# EAGLE design CrackberryPi_1.0.6.2_parts (EAGLE 7.2.0)
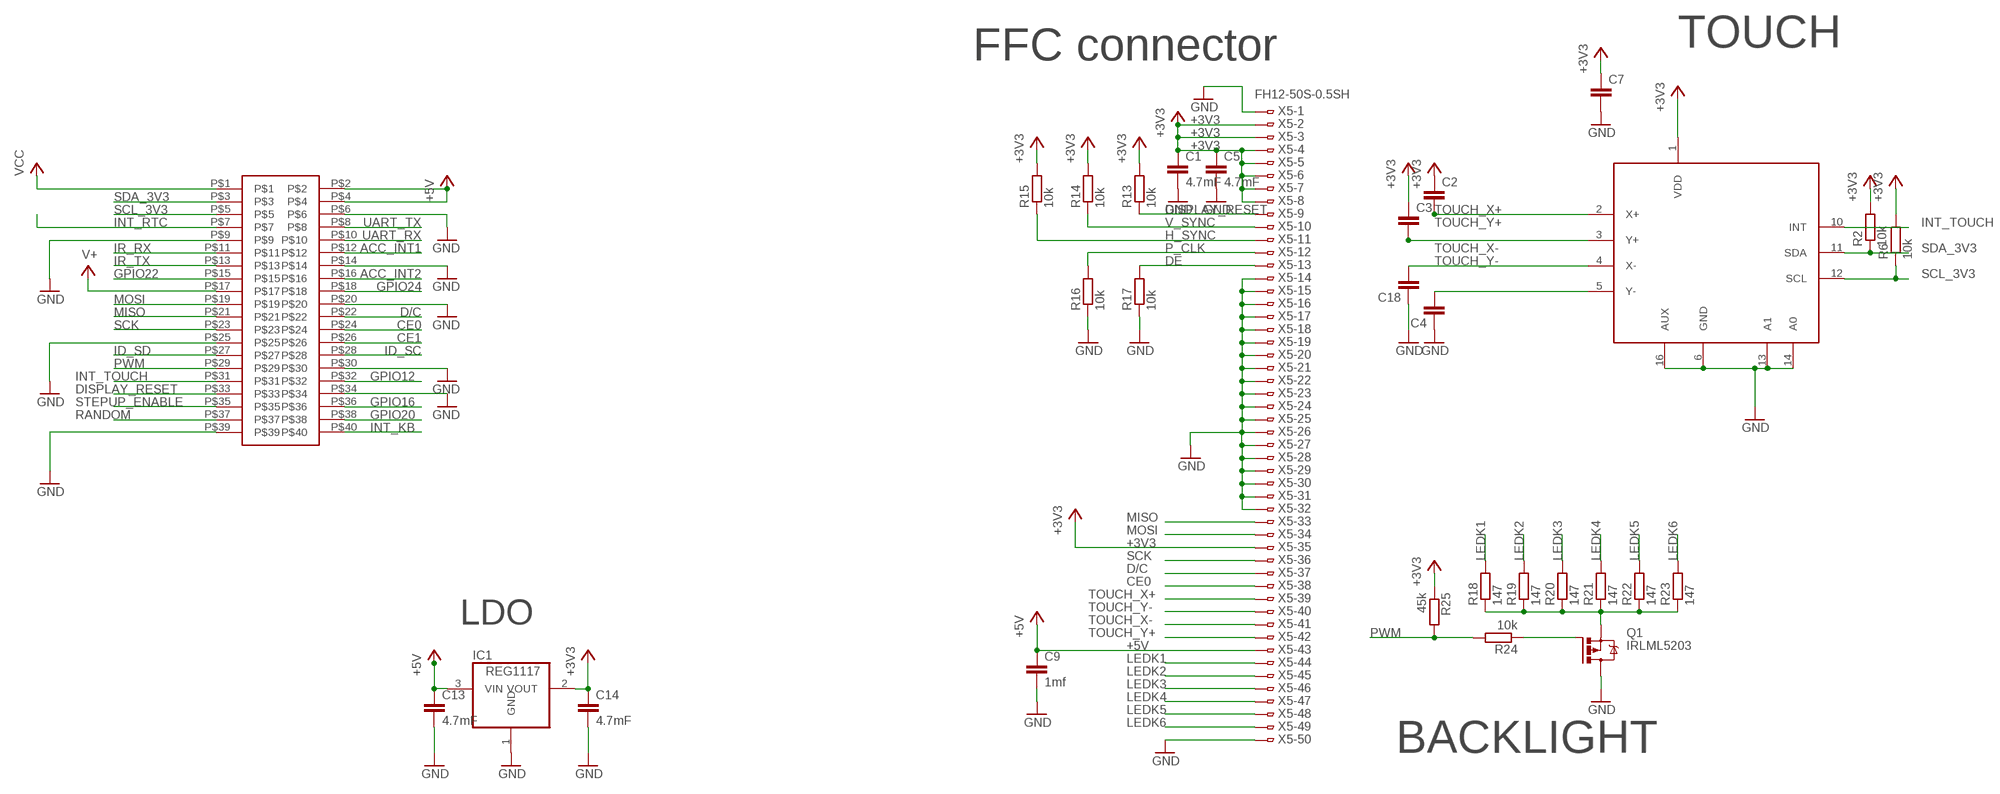
[diagram p0: schematic, sheet 1]

## Parts
C1  4.7mF  C-EUC0603  [C0603]
C2  C-EUC0603  [C0603]
C3  C-EUC0603  [C0603]
C4  C-EUC0603  [C0603]
C5  4.7mF  C-EUC0603  [C0603]
C7  C-EUC0603  [C0603]
C9  1mf  C-EUC0603  [C0603]
C13  4.7mF  C-EUC0603  [C0603]
C14  4.7mF  C-EUC0603  [C0603]
C18  C-EUC0603  [C0603]
IC1  REG1117  [SOT223]
Q1  IRLML5203  [MICRO3]
R2  10k  R-EU_R0603  [R0603]
R6  10k  R-EU_R0603  [R0603]
R13  10k  R-EU_R0603  [R0603]
R14  10k  R-EU_R0603  [R0603]
R15  10k  R-EU_R0603  [R0603]
R16  10k  R-EU_R0603  [R0603]
R17  10k  R-EU_R0603  [R0603]
R18  147  R-EU_R0603  [R0603]
R19  147  R-EU_R0603  [R0603]
R20  147  R-EU_R0603  [R0603]
R21  147  R-EU_R0603  [R0603]
R22  147  R-EU_R0603  [R0603]
R23  147  R-EU_R0603  [R0603]
R24  10k  R-EU_R0603  [R0603]
R25  45k  R-EU_R0603  [R0603]
U$6  TSC2007  [TSSOP16]
U$11  HEADER  [20X2]
X5  FH12-50S-0.5SH  [FH12-50S-0.5SH]

## Nets
+3V3: C1.1 C2.1 C3.1 C5.1 C7.1 C14.1 IC1.2(VOUT) R2.2 R6.2 R13.2 R14.2 R15.2 R25.1 U$6.1(VDD) X5.2 X5.3 X5.4 X5.5 X5.6 X5.7 X5.8 X5.35
+5V: C9.1 C13.1 IC1.3(VIN) U$11.P$2 U$11.P$4 X5.43
ACC_INT1: U$11.P$12
ACC_INT2: U$11.P$16
CE0: U$11.P$24 X5.38
CE1: U$11.P$26
D/C: U$11.P$22 X5.37
DE: R17.2 X5.13
DISPLAY_RESET: R13.1 U$11.P$33 X5.9
GND: C1.2 C4.1 C5.2 C7.2 C9.2 C13.2 C14.2 C18.1 IC1.1(GND) Q1.3(D) R16.1 R17.1 U$6.6(GND) U$6.13(A1) U$6.14(A0) U$6.16(AUX) U$11.P$6 U$11.P$9 U$11.P$14 U$11.P$20 U$11.P$25 U$11.P$30 U$11.P$34 U$11.P$39 X5.1 X5.14 X5.15 X5.16 X5.17 X5.18 X5.19 X5.20 X5.21 X5.22 X5.23 X5.24 X5.25 X5.26 X5.27 X5.28 X5.29 X5.30 X5.31 X5.32 X5.50
GPIO12: U$11.P$32
GPIO16: U$11.P$36
GPIO20: U$11.P$38
GPIO22: U$11.P$15
GPIO24: U$11.P$18
H_SYNC: R15.1 X5.11
ID_SC: U$11.P$28
ID_SD: U$11.P$27
INT_KB: U$11.P$40
INT_RTC: U$11.P$7
INT_TOUCH: U$6.10(INT) U$11.P$31
IR_RX: U$11.P$11
IR_TX: U$11.P$13
LEDK1: R18.2 X5.44
LEDK2: R19.2 X5.45
LEDK3: R20.2 X5.46
LEDK4: R21.2 X5.47
LEDK5: R22.2 X5.48
LEDK6: R23.2 X5.49
MISO: U$11.P$21 X5.33
MOSI: U$11.P$19 X5.34
N$12: Q1.2(S) R18.1 R19.1 R20.1 R21.1 R22.1 R23.1
N$20: Q1.1(G) R24.1
P_CLK: R16.2 X5.12
PWM: R24.2 R25.2 U$11.P$29
RANDOM: U$11.P$37
SCK: U$11.P$23 X5.36
SCL_3V3: R6.1 U$6.12(SCL) U$11.P$5
SDA_3V3: R2.1 U$6.11(SDA) U$11.P$3
STEPUP_ENABLE: U$11.P$35
TOUCH_X+: C2.2 U$6.2(X+) X5.39
TOUCH_X-: C18.2 U$6.4(X-) X5.41
TOUCH_Y+: C3.2 U$6.3(Y+) X5.42
TOUCH_Y-: C4.2 U$6.5(Y-) X5.40
UART_RX: U$11.P$10
UART_TX: U$11.P$8
V+: U$11.P$17
V_SYNC: R14.1 X5.10
VCC: U$11.P$1

## Notes on the sheet
- FFC connector | TOUCH
- LDO
- BACKLIGHT

## Library data of the parts
C1-C5 C7 C9 C13 C14 C18 = rcl:C-EU: CAPACITOR, European symbol
IC1 = burr-brown:REG1117: 800mA and 1A Low Dropout (LDO) Positive Regulator 1.8V, 2.5V, 2.85V, 3.3V, 5V, and Adj; MPN: REG1117; OC_FARNELL: 1097566; OC_NEWARK: 14P6981
Q1 = transistor-power:IRLML5203: HEXFET P-Channel Power MOSFET
R2 R6 R13-R25 = rcl:R-EU_: RESISTOR, European symbol
U$6 = tsc2046:TSC2007
U$11 = 20x2_cirqoid:HEADER
X5 = FCI_62684:FH12-50S-0.5S: 0.5mm Pitch Connectors For FPC/FFC Source: Data sheet <http://www.hirose.co.jp/cataloge_hp/e58605370.pdf>; MPN: FH12-50S-0.5SH(55); OC_FARNELL: 1324557; OC_NEWARK: 34M6181

## Board
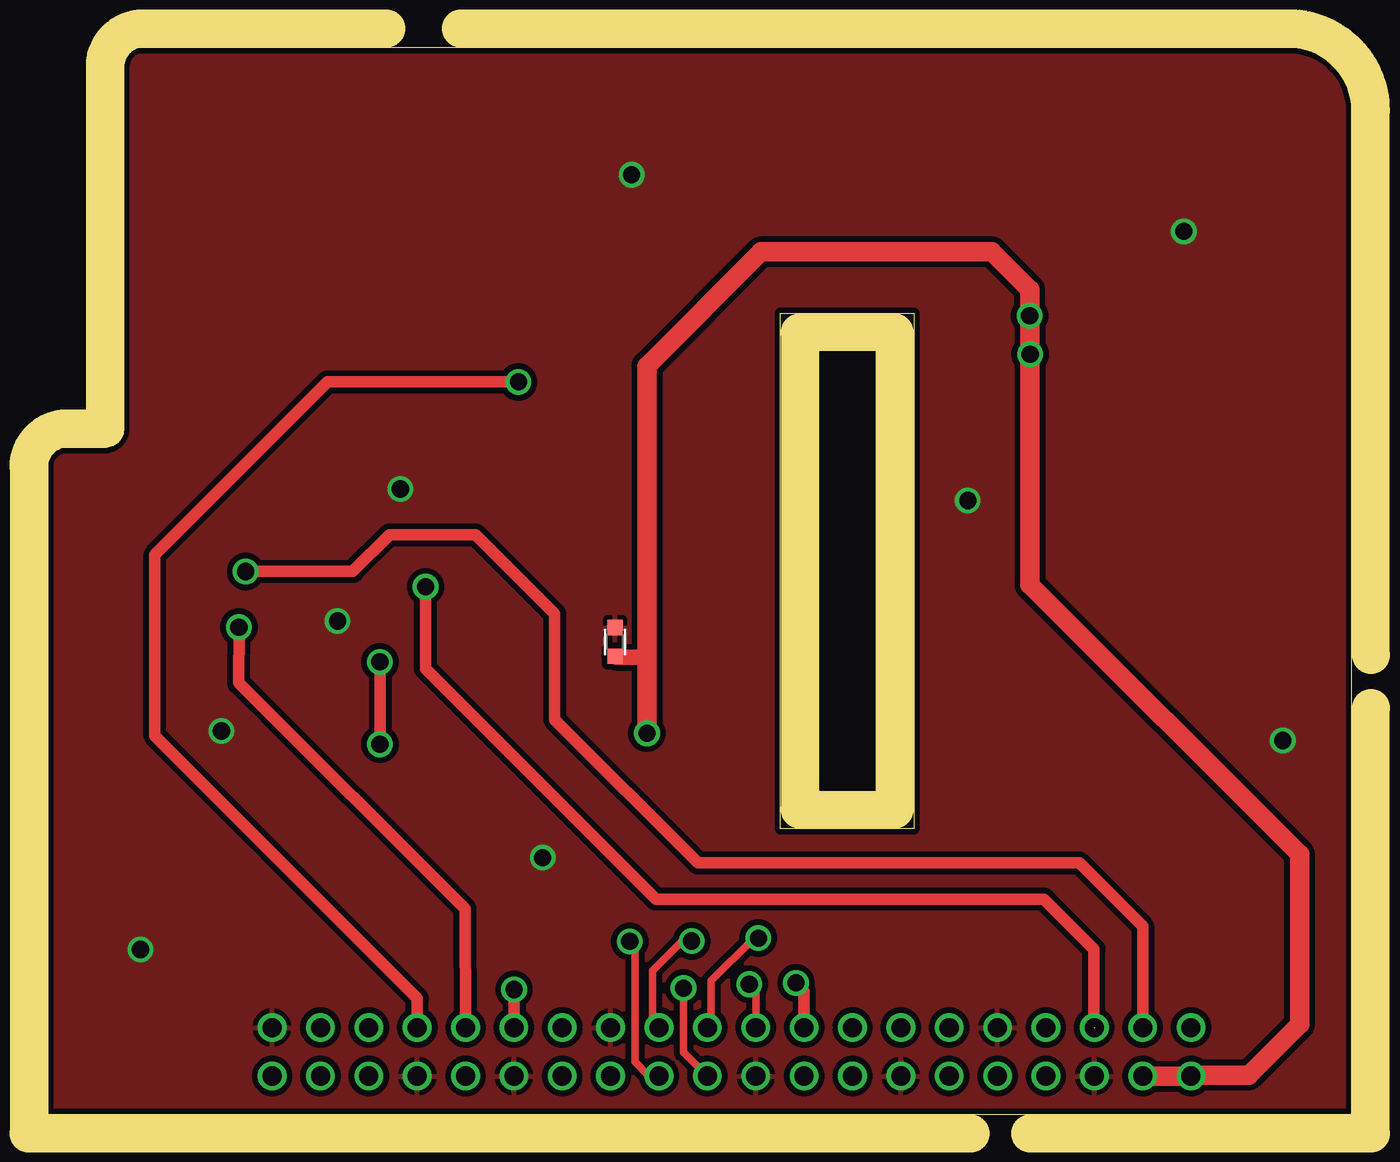
[diagram p1: board, top side]
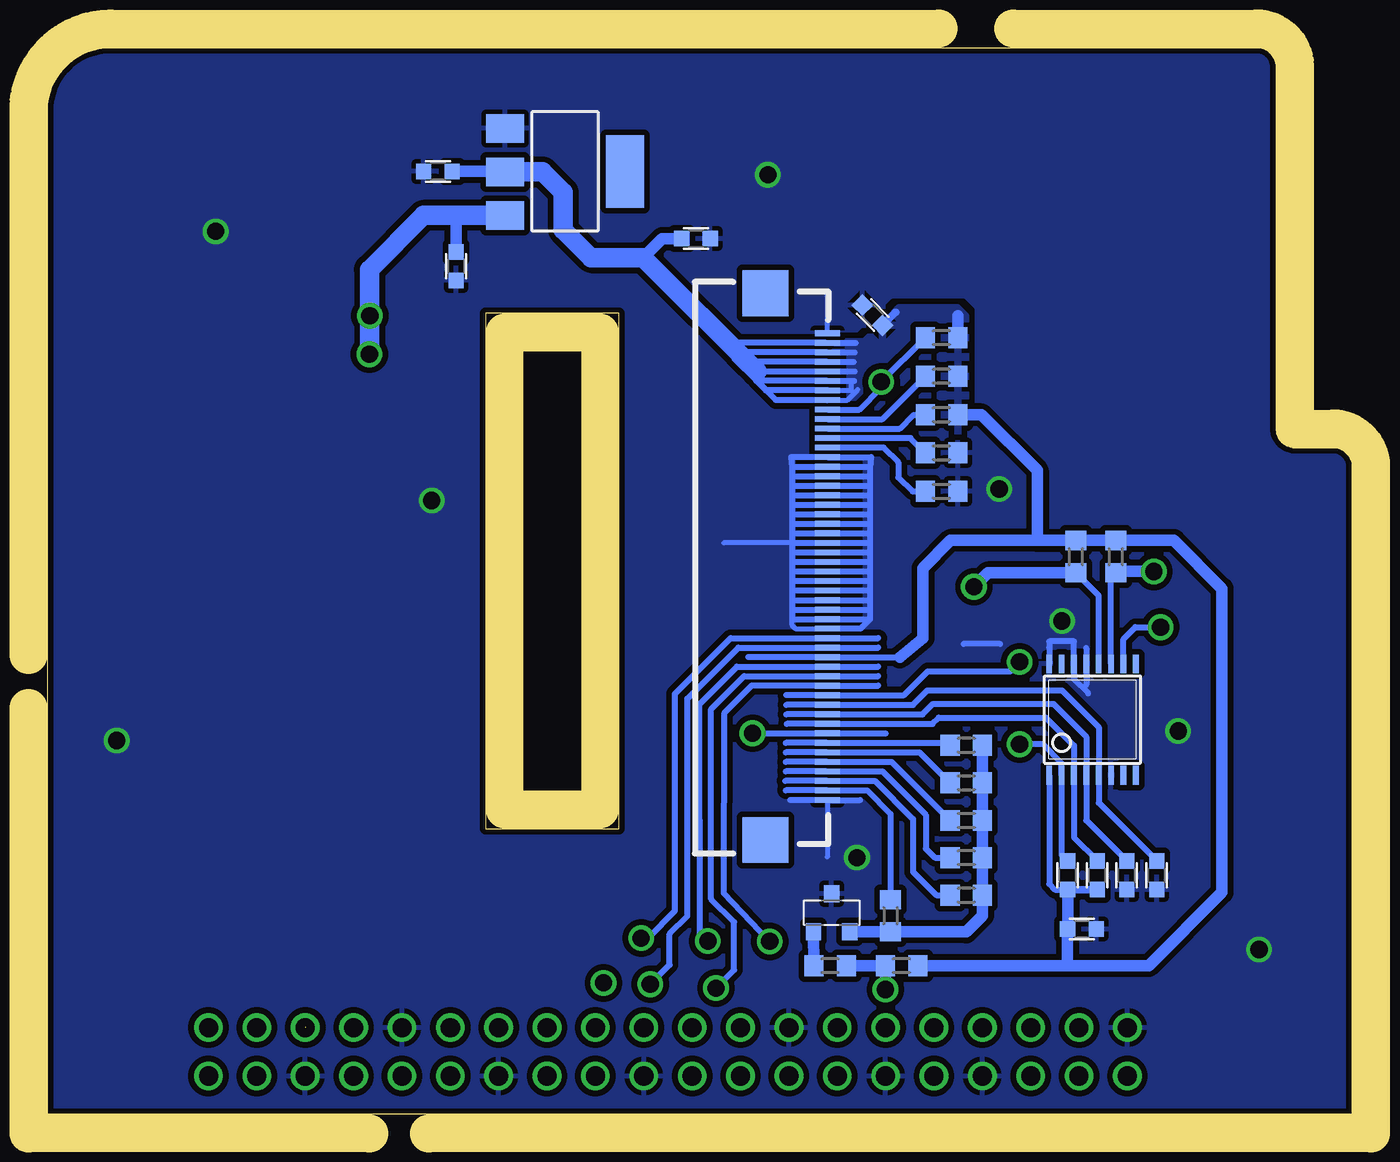
[diagram p2: board, bottom side, seen from below]

Size 68.5 x 56 mm. Coordinates in mm from the lower left corner, seen from the top.
Outline: 0,34 0,0 68.5,0 68.5,52.7 arc90 65.2,56 5,56 arc90 4,55 4,36 arc-90 3,35 1,35 arc90 0,34
Outline: 45.5,15 38.5,15 38.5,42.05 45.5,42.05 45.5,15
Copper layers (1*16): Top 0.035mm / dielectric 1.5mm / Bottom 0.035mm
Design rules "SeeedStudio_2layer_DRU_no_angle_20140221": minimum track width 6mil, minimum drill 12mil, track to track 6mil, track to pad 6mil, pad to pad 6mil, via to via 6mil, smd to smd 0mil, copper to edge 10mil, drill to drill 10mil, minimum pad ring 10mil, minimum via ring 6mil, stop-mask expansion 2mil, vias tented up to drill 100mil, thermal gap 10mil
tRestrict: area 38.5,15 to 45.5,42
bRestrict: area 26,33.2 to 28.9,33.3; area 26,32.7 to 28.9,32.8; area 26,32.2 to 28.9,32.3; area 26,31.7 to 28.9,31.8; area 26,31.2 to 28.9,31.3; area 26,30.7 to 28.9,30.8; area 26,30.2 to 28.9,30.3; area 26,29.7 to 28.9,29.8; area 26,29.2 to 28.9,29.3; area 26,28.7 to 28.9,28.8; area 26,28.2 to 28.9,28.3; area 26,27.7 to 28.9,27.8; 13 more areas
Milling: 17 lines

### Footprints (pad centres in the part's own frame; a part is rotated, then mirrored left to right if it is on the bottom)
C0603 = smd 0.8 x 0.8: 1 -0.75,0; 2 0.75,0
SOT223 = smd 1.499 x 2.007: 1 -2.261,-3.15; 2 0.025,-3.15; 3 2.311,-3.15 | smd 3.81 x 2.007: 4 0,3.15
MICRO3 = smd 0.8 x 0.9: 1 -0.95,-1; 2 0.95,-1; 3 0,1
R0603 = smd 1 x 1.1: 1 -0.85,0; 2 0.85,0
TSSOP16 = smd 0.305 x 0.991: 1 -2.275,-2.918; 2 -1.625,-2.918; 3 -0.975,-2.918; 4 -0.325,-2.918; 5 0.325,-2.918; 6 0.975,-2.918; 7 1.625,-2.918; 8 2.275,-2.918; 9 2.275,2.918; 10 1.625,2.918; 11 0.975,2.918; 12 0.325,2.918; 13 -0.325,2.918; 14 -0.975,2.918; 15 -1.625,2.918; 16 -2.275,2.918
20X2 = drill 1: P$1 0,0; P$2 0,2.54; P$3 2.54,0; P$4 2.54,2.54; P$5 5.08,0; P$6 5.08,2.54; P$7 7.62,0; P$8 7.62,2.54; P$9 10.16,0; P$10 10.16,2.54; P$11 12.7,0; P$12 12.7,2.54; P$13 15.24,0; P$14 15.24,2.54; P$15 17.78,0; P$16 17.78,2.54; P$17 20.32,0; P$18 20.32,2.54; P$19 22.86,0; P$20 22.86,2.54; P$21 25.4,0; P$22 25.4,2.54; P$23 27.94,0; P$24 27.94,2.54; P$25 30.48,0; P$26 30.48,2.54; P$27 33.02,0; P$28 33.02,2.54; P$29 35.56,0; P$30 35.56,2.54; P$31 38.1,0; P$32 38.1,2.54; P$33 40.64,0; P$34 40.64,2.54; P$35 43.18,0; P$36 43.18,2.54; P$37 45.72,0; P$38 45.72,2.54; P$39 48.26,0; P$40 48.26,2.54
FH12-50S-0.5SH = smd 1.3 x 0.3: 1 3.95,27.8; 2 3.95,27.3; 3 3.95,26.8; 4 3.95,26.3; 5 3.95,25.8; 6 3.95,25.3; 7 3.95,24.8; 8 3.95,24.3; 9 3.95,23.8; 10 3.95,23.3; 11 3.95,22.8; 12 3.95,22.3; 13 3.95,21.8; 14 3.95,21.3; 15 3.95,20.8; 16 3.95,20.3; 17 3.95,19.8; 18 3.95,19.3; 19 3.95,18.8; 20 3.95,18.3; 21 3.95,17.8; 22 3.95,17.3; 23 3.95,16.8; 24 3.95,16.3; 25 3.95,15.8; 26 3.95,15.3; 27 3.95,14.8; 28 3.95,14.3; 29 3.95,13.8; 30 3.95,13.3; 31 3.95,12.8; 32 3.95,12.3; 33 3.95,11.8; 34 3.95,11.3; 35 3.95,10.8; 36 3.95,10.3; 37 3.95,9.8; 38 3.95,9.3; 39 3.95,8.8; 40 3.95,8.3; 41 3.95,7.8; 42 3.95,7.3; 43 3.95,6.8; 44 3.95,6.3; 45 3.95,5.8; 46 3.95,5.3; 47 3.95,4.8; 48 3.95,4.3; 49 3.95,3.8; 50 3.95,3.3 | smd 2.4 x 2.4: P$1 0.7,1.2; P$2 0.7,29.9

### Placement (x,y rotation side)
C1  25.18,41.95 135 bottom
C2  14.93,12.55 90 bottom
C3  13.38,12.55 90 bottom
C4  10.25,12.55 90 bottom
C5  34.45,45.98 0 bottom
C7  14.18,9.72 0 bottom
C9  29.8,24.8 90 top
C13  47.05,44.52 270 bottom
C14  48,49.5 180 bottom
C18  11.82,12.55 90 bottom
IC1  41.33,49.5 270 bottom
Q1  27.32,10.57 0 bottom
R2  12.4,29.27 90 bottom
R6  14.5,29.27 90 bottom
R13  21.55,40.77 0 bottom
R14  21.55,38.75 0 bottom
R15  21.55,36.73 0 bottom
R16  21.55,34.73 180 bottom
R17  21.55,32.7 180 bottom
R18  20.25,19.38 180 bottom
R19  20.25,17.4 180 bottom
R20  20.25,15.43 180 bottom
R21  20.25,13.47 180 bottom
R22  20.25,11.5 180 bottom
R23  24.23,10.43 90 bottom
R24  27.4,7.8 0 bottom
R25  23.65,7.8 180 bottom
U$6  13.62,20.73 0 bottom
U$11  60.05,4.55 180 top
X5  31.5,13.2 0 bottom

### Tracks (layer width: path | path; a pad name or v marks a point on that pad's centre or on a via)
+3V3
  Bottom 0.254: X5.3 27.52,39.98 | X5.8 27.48,37.5 26.5,37.5 25.95,38.05 | X5.7 26.27,38 26.27,38.5
  Bottom 0.305: 23.75,24 X5.35 31.7,24 | 26.15,38.5 26.27,38.5 X5.6 31.25,38.5 | 26.1,39 X5.5 31.25,39 | 26.18,39.5 X5.4 31.77,39.5 32.1,39.83 | 26.12,40 X5.3 32.2,40 32.48,40.27 | X5.2 26.05,40.5 | U$6.1 15.9,12.1 15.6,11.8 C2.1 | 27.57,37.5 X5.8 | 31.25,38.5 32.45,39.7 | 27.48,37.5 30.25,37.5 31.25,38.5
  Bottom 0.406: 23.95,42.1 23.96,42.1 C1.1 | C3.1 C2.1
  Bottom 0.61: 20.7,41.92 R13.2 | R15.2 19.45,36.73 16.52,33.8 16.52,30.12 | C2.1 C7.1 14.95,9.7 14.95,7.8 | 16.52,30.12 R6.2 R2.2 9.35,30.12 6.83,27.6 6.83,11.65 10.68,7.8 14.95,7.8 | C14.1 44.5,49.5 IC1.2 | 14.95,7.8 R25.1 | 16.52,30.12 21.07,30.12 22.52,28.68 22.52,25 23.75,24 | C5.1 36.23,45.98 37.23,44.98
  Bottom 1.016: IC1.2 42.5,49.48 41.42,48.4 41.42,46.45 39.95,44.98 37.23,44.98 31.25,39
  pour Bottom (isolate 0.305): 20.3,35.88 28.1,35.88 28.1,40.55 25.6,40.55 23.8,42.35 20.73,42.35 20.3,41.92
+5V  (via drill 0.9)
  Top 0.813: C9.1 29.85,24 31.48,24
  Top 1.016: U$11.P$4 U$11.P$2 60.05,2.05 63.08,2.05 65.75,4.72 65.75,13.65 51.6,27.8 v51.6,39.9 51.6,41.9 v51.58,41.92 51.58,43.3 49.6,45.27 37.48,45.27 31.48,39.27 31.48,24 v31.48,20
  Bottom 0.254: U$11.P$2 60.05,2.05
  Bottom 0.305: 24.48,20 X5.43 v31.48,20
  Bottom 0.61: C13.1 47.05,47.19
  Bottom 1.016: IC1.3 47.05,47.19 48.76,47.19 51.6,44.35 v51.6,39.9
CE0  (via drill 0.9)
  Top 0.406: v30.57,9.07 30.85,8.8 30.85,2.75 31.59,2.01 U$11.P$24
  Bottom 0.305: 24.88,22.5 X5.38 31.52,22.5 32.98,21.05 33,11.62 v30.57,9.07
D/C  (via drill 0.9)
  Top 0.406: U$11.P$22 33.4,3.26 v33.4,6.62
  Bottom 0.305: 27.65,23 X5.37 | X5.37 24.88,23 | v33.4,6.62 32.45,7.58 32.45,10.1 33.65,11.3 33.65,21.27 31.93,23 X5.37
DE
  Bottom 0.305: X5.13 24.6,35 23.82,34.23 23.82,33.42 23.07,32.7 R17.2
DISPLAY_RESET  (via drill 0.9)
  Top 0.61: U$11.P$33 19.41,6.09 5.62,19.88 5.62,29.38 14.7,38.45 v24.73,38.45
  Bottom 0.305: R13.1 v24.73,38.45 24.73,38.15 25.88,37 X5.9
GND  (via drill 0.9)
  Bottom 0.254: 27.5,25.5 29.23,25.5 29.4,25.68 29.4,26 | X5.50 27.55,13.5 | X5.1 27.55,42.98 | 29.4,30 33,30
  Bottom 0.305: 25.3,34 25.25,34.5 X5.14 29.45,34.5 29.4,34 | 25.3,34 25.3,33.5 | 25.3,33.5 25.3,33 | 25.3,33 25.3,32.5 | 25.3,32.5 25.3,32 | 25.3,32 25.3,31.5 | 25.3,31.5 25.3,31 | 25.3,31 25.3,30.5 | 25.3,30.5 25.3,30 | 25.3,30 25.3,29.5 | 25.3,28.5 25.3,28 | 25.3,28 25.3,27.5 | 25.3,27.5 25.3,27 | 25.3,27 25.3,26.5 | 25.3,26.5 25.3,26 | 25.3,26 25.8,25.5 27.5,25.5 X5.32 | 25.3,26 X5.31 29.4,26 29.4,26.5 | 25.3,26.5 X5.30 29.4,26.5 | 25.3,27 X5.29 29.4,27 | 25.3,27.5 X5.28 29.4,27.5 | 25.3,28 X5.27 29.4,28 | 25.3,28.5 X5.26 29.4,28.5 | 25.3,29.5 X5.24 29.4,29.5 | 25.3,29.5 25.3,29 | 25.3,29 X5.25 29.4,29 | 25.3,29 25.3,28.5 | 25.3,30 X5.23 29.4,30 | 25.3,30.5 X5.22 29.4,30.5 | 25.3,31 X5.21 29.4,31 | 25.3,31.5 X5.20 29.4,31.5 | 25.3,32 X5.19 29.4,32 | 25.3,32.5 X5.18 29.4,32.5 | 25.3,33 X5.17 29.4,33 | 25.3,34 X5.15 29.4,34 | 25.3,33.5 X5.16 29.4,33.5 | 29.4,34 29.4,33.5 | 29.4,33.5 29.4,33 | 29.4,33 29.4,32.5 | 29.4,32.5 29.4,32 | 29.4,32 29.4,31.5 | 29.4,31.5 29.4,31 | 29.4,31 29.4,30.5 | 29.4,30.5 29.4,30 | 29.4,30 29.4,29.5 | 29.4,29.5 29.4,29 | 29.4,29 29.4,28.5 | 29.4,28.5 29.4,28 | 29.4,28 29.4,27.5 | 29.4,27.5 29.4,27 | 29.4,27 29.4,26.5 | 18.48,24.7 20.4,24.7 | 15.9,24.5 U$6.16 15.9,24.82 14.6,24.82 U$6.14 14.6,22.85 13.85,22.1 | 13.95,22.55 U$6.13 13.95,24.48 | 29.5,16.5 X5.50 25.82,16.5
  other vias: 26,13.47 64.88,19.62 59.67,46.35 30.68,49.33 18.52,32.83 15.22,25.9 4.88,8.65 48.33,32.23 9.12,20.12
  pour Bottom (isolate 0.305, rank 6): 0,34 0,0 68.65,0 68.65,52.7 arc90 65.1,56 4.91,56 arc90 4,54.84 4,36.02 arc-90 2.98,35 1,35 arc90
  pour Top (isolate 0.305, rank 6): 0,34 0,0 68.62,0 68.62,52.83 arc90 65.1,56 5,56 arc90 4,55 4,36 arc-90 3,35 1,35 arc90
H_SYNC
  Bottom 0.305: X5.11 23.75,36 23.02,36.73 R15.1
INT_TOUCH  (via drill 0.9)
  Top 0.61: U$11.P$31 21.93,10.8 10.03,22.65 v10.05,25.57
  Bottom 0.305: 12,23.62 U$6.10 12,24.95 11.38,25.57 v10.05,25.57
LEDK1
  Bottom 0.305: X5.44 21.23,19.5 R18.2
LEDK2
  Bottom 0.305: X5.45 22.7,19 R19.2
LEDK3
  Bottom 0.305: R20.2 24.18,18.5 X5.46 29.73,18.5
LEDK4
  Bottom 0.305: X5.47 24.65,18 22.38,15.72 22.38,13.95 21.9,13.47 R21.2
LEDK5
  Bottom 0.254: 21.15,11.65 R22.2
  Bottom 0.305: R22.2 21.82,11.5 23.05,12.72 23.05,15.5 25.05,17.5 27.45,17.5 X5.48 29.75,17.5
LEDK6
  Bottom 0.305: 29.73,17 X5.49 25.45,17 24.23,15.78 R23.2
MISO  (via drill 0.9)
  Top 0.305: 37.05,9.2 37.1,9.25 v37.33,9.25
  Top 0.406: U$11.P$21 34.85,4.75 34.85,7 37.05,9.2
  Bottom 0.305: 27.62,25 X5.33 | X5.33 24.88,25 | v37.33,9.25 36.98,9.25 35.55,10.68 35.55,22.07 32.62,25 X5.33
MOSI  (via drill 0.9)
  Top 0.406: U$11.P$19 37.19,6.49 v36.85,6.83
  Bottom 0.305: 27.57,24.5 X5.34 | X5.34 24.88,24.5 | v36.85,6.83 35.83,7.85 35.83,9.47 34.9,10.4 34.9,21.82 32.23,24.5 X5.34
N$4
  Bottom 0.305: 27.6,22 29.7,22
N$5
  Bottom 0.305: 27.6,21 29.7,21
N$6
  Bottom 0.305: 27.57,20.5 29.68,20.5
N$7
  Bottom 0.305: 27.57,19.5 29.73,19.5
N$8
  Bottom 0.305: 27.57,19 29.73,19
N$9
  Bottom 0.305: 27.6,18 29.73,18
N$11
  Bottom 0.305: 27.62,40.5 32.88,40.5 33.2,40.83
N$12
  Bottom 0.61: R18.1 R19.1 R20.1 R21.1 R22.1 19.4,10.43 20.25,9.57 R23.1 Q1.2
N$13
  Bottom 0.305: 27.5,38 30.77,38 31.27,38.5
N$20
  Bottom 0.61: Q1.1 R24.1
P_CLK
  Bottom 0.305: R16.2 23.18,35.5 X5.12
PWM  (via drill 0.9)
  Top 0.61: v24.5,6.55 U$11.P$29
  Bottom 0.61: U$11.P$29 | R24.2 R25.2 v24.5,6.55
SCK  (via drill 0.9)
  Top 0.406: U$11.P$23 31.77,4.88 31.77,7.53 33.35,9.1 v33.83,9.1
  Bottom 0.305: 27.62,23.5 X5.36 | X5.36 24.88,23.5 | v33.83,9.1 34.25,9.5 34.27,21.52 32.3,23.5 X5.36
SCL_3V3  (via drill 0.9)  (1 unrouted)
  Top 0.61: 54.95,4.57 54.95,8.68 52.33,11.3 31.95,11.3 19.85,23.4 v19.85,27.7
  Bottom 0.305: U$6.12 13.3,27.23 R6.1
  Bottom 0.61: R6.1 19.12,28.43 v19.85,27.7
SDA_3V3  (via drill 0.9)
  Top 0.61: v10.4,28.5 16.02,28.5 17.95,30.43 22.48,30.43 26.62,26.27 26.62,20.73 34.15,13.2 54.17,13.2 57.51,9.87 U$11.P$3
  Bottom 0.305: U$6.11 12.65,28.18 R2.1
  Bottom 0.61: v10.4,28.5 12.32,28.5 R2.1
TOUCH_X+  (via drill 0.9)
  Top 0.61: v17.45,23.75 v17.45,19.43
  Bottom 0.305: C2.2 15.25,13.62 U$6.2 15.25,18.43 16.23,19.43 v17.45,19.43 | X5.39 23.52,22 22.27,23.25 17.95,23.25 v17.45,23.75
TOUCH_X-
  Bottom 0.305: C18.2 13.95,15.43 U$6.4 13.95,19.82 15.68,21.55 22,21.55 22.55,21 X5.41
TOUCH_Y+
  Bottom 0.305: C3.2 14.6,14.53 U$6.3 14.6,19.35 16.07,20.82 21.7,20.82 22.02,20.5 X5.42
TOUCH_Y-
  Bottom 0.254: X5.40 27.5,21.5
  Bottom 0.305: C4.2 13.3,16.35 U$6.5 13.3,20.32 15.22,22.25 22.3,22.25 23.05,21.5 27.5,21.5 29.7,21.5
V+  (via drill 0.9)
  Top 0.61: v39.3,6.9 39.73,6.47 U$11.P$17
  Bottom 0.406: 39.62,4.66 U$11.P$17
V_SYNC
  Bottom 0.305: X5.10 24.65,36.5 R14.1